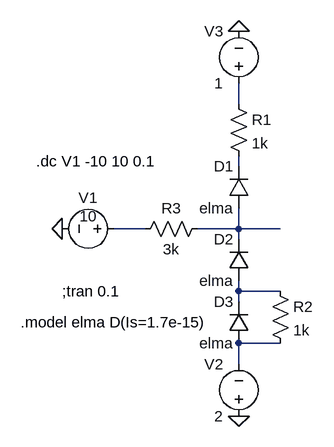
[diagram p0: schematic Draft1.asc]
Draft1.asc, the LTspice schematic file:
Version 4
SHEET 1 880 680
WIRE 384 48 384 16
WIRE 384 144 384 128
WIRE 240 240 192 240
WIRE 384 240 384 208
WIRE 384 240 320 240
WIRE 448 240 384 240
WIRE 384 256 384 240
WIRE 384 336 384 320
WIRE 448 336 384 336
WIRE 384 352 384 336
WIRE 448 416 384 416
WIRE 384 448 384 416
FLAG 384 528 0
FLAG 384 -64 0
FLAG 112 240 0
SYMBOL res 368 32 R0
SYMATTR InstName R1
SYMATTR Value 1k
SYMBOL diode 400 208 R180
WINDOW 0 24 64 Left 2
WINDOW 3 24 0 Left 2
SYMATTR InstName D1
SYMATTR Value elma
SYMBOL diode 400 320 R180
WINDOW 0 24 64 Left 2
WINDOW 3 24 0 Left 2
SYMATTR InstName D2
SYMATTR Value elma
SYMBOL diode 400 416 R180
WINDOW 0 24 64 Left 2
WINDOW 3 24 0 Left 2
SYMATTR InstName D3
SYMATTR Value elma
SYMBOL res 432 320 R0
SYMATTR InstName R2
SYMATTR Value 1k
SYMBOL res 336 224 R90
WINDOW 0 0 56 VBottom 2
WINDOW 3 32 56 VTop 2
SYMATTR InstName R3
SYMATTR Value 3k
SYMBOL voltage 208 240 R90
WINDOW 0 -32 56 VBottom 2
WINDOW 3 -4 56 VBottom 2
WINDOW 123 0 0 Left 2
WINDOW 39 0 0 Left 2
SYMATTR InstName V1
SYMATTR Value 10
SYMBOL voltage 384 544 R180
WINDOW 0 24 96 Left 2
WINDOW 3 24 16 Left 2
WINDOW 123 0 0 Left 2
WINDOW 39 0 0 Left 2
SYMATTR InstName V2
SYMATTR Value 2
SYMBOL voltage 384 32 R180
WINDOW 0 24 96 Left 2
WINDOW 3 24 16 Left 2
WINDOW 123 0 0 Left 2
WINDOW 39 0 0 Left 2
SYMATTR InstName V3
SYMATTR Value 1
TEXT 48 384 Left 2 !.model elma D(Is=1.7e-15)
TEXT 112 336 Left 2 !;tran 0.1
TEXT 72 136 Left 2 !.dc V1 -10 10 0.1

The netlist it stands for:
* Draft1.asc
R1 N001 N002 1k
D1 N004 N002 elma
D2 N005 N004 elma
D3 N006 N005 elma
R2 N005 N006 1k
R3 N004 N003 3k
V1 N003 0 10
V2 0 N006 2
V3 N001 0 1
.model D D
.lib standard.dio
.model elma D(Is=1.7e-15)
;tran 0.1
.dc V1 -10 10 0.1
.backanno
.end